# Altium schematic sheet controller_board.SchDoc
size A3; SheetNumber: 2; SheetTotal: 5
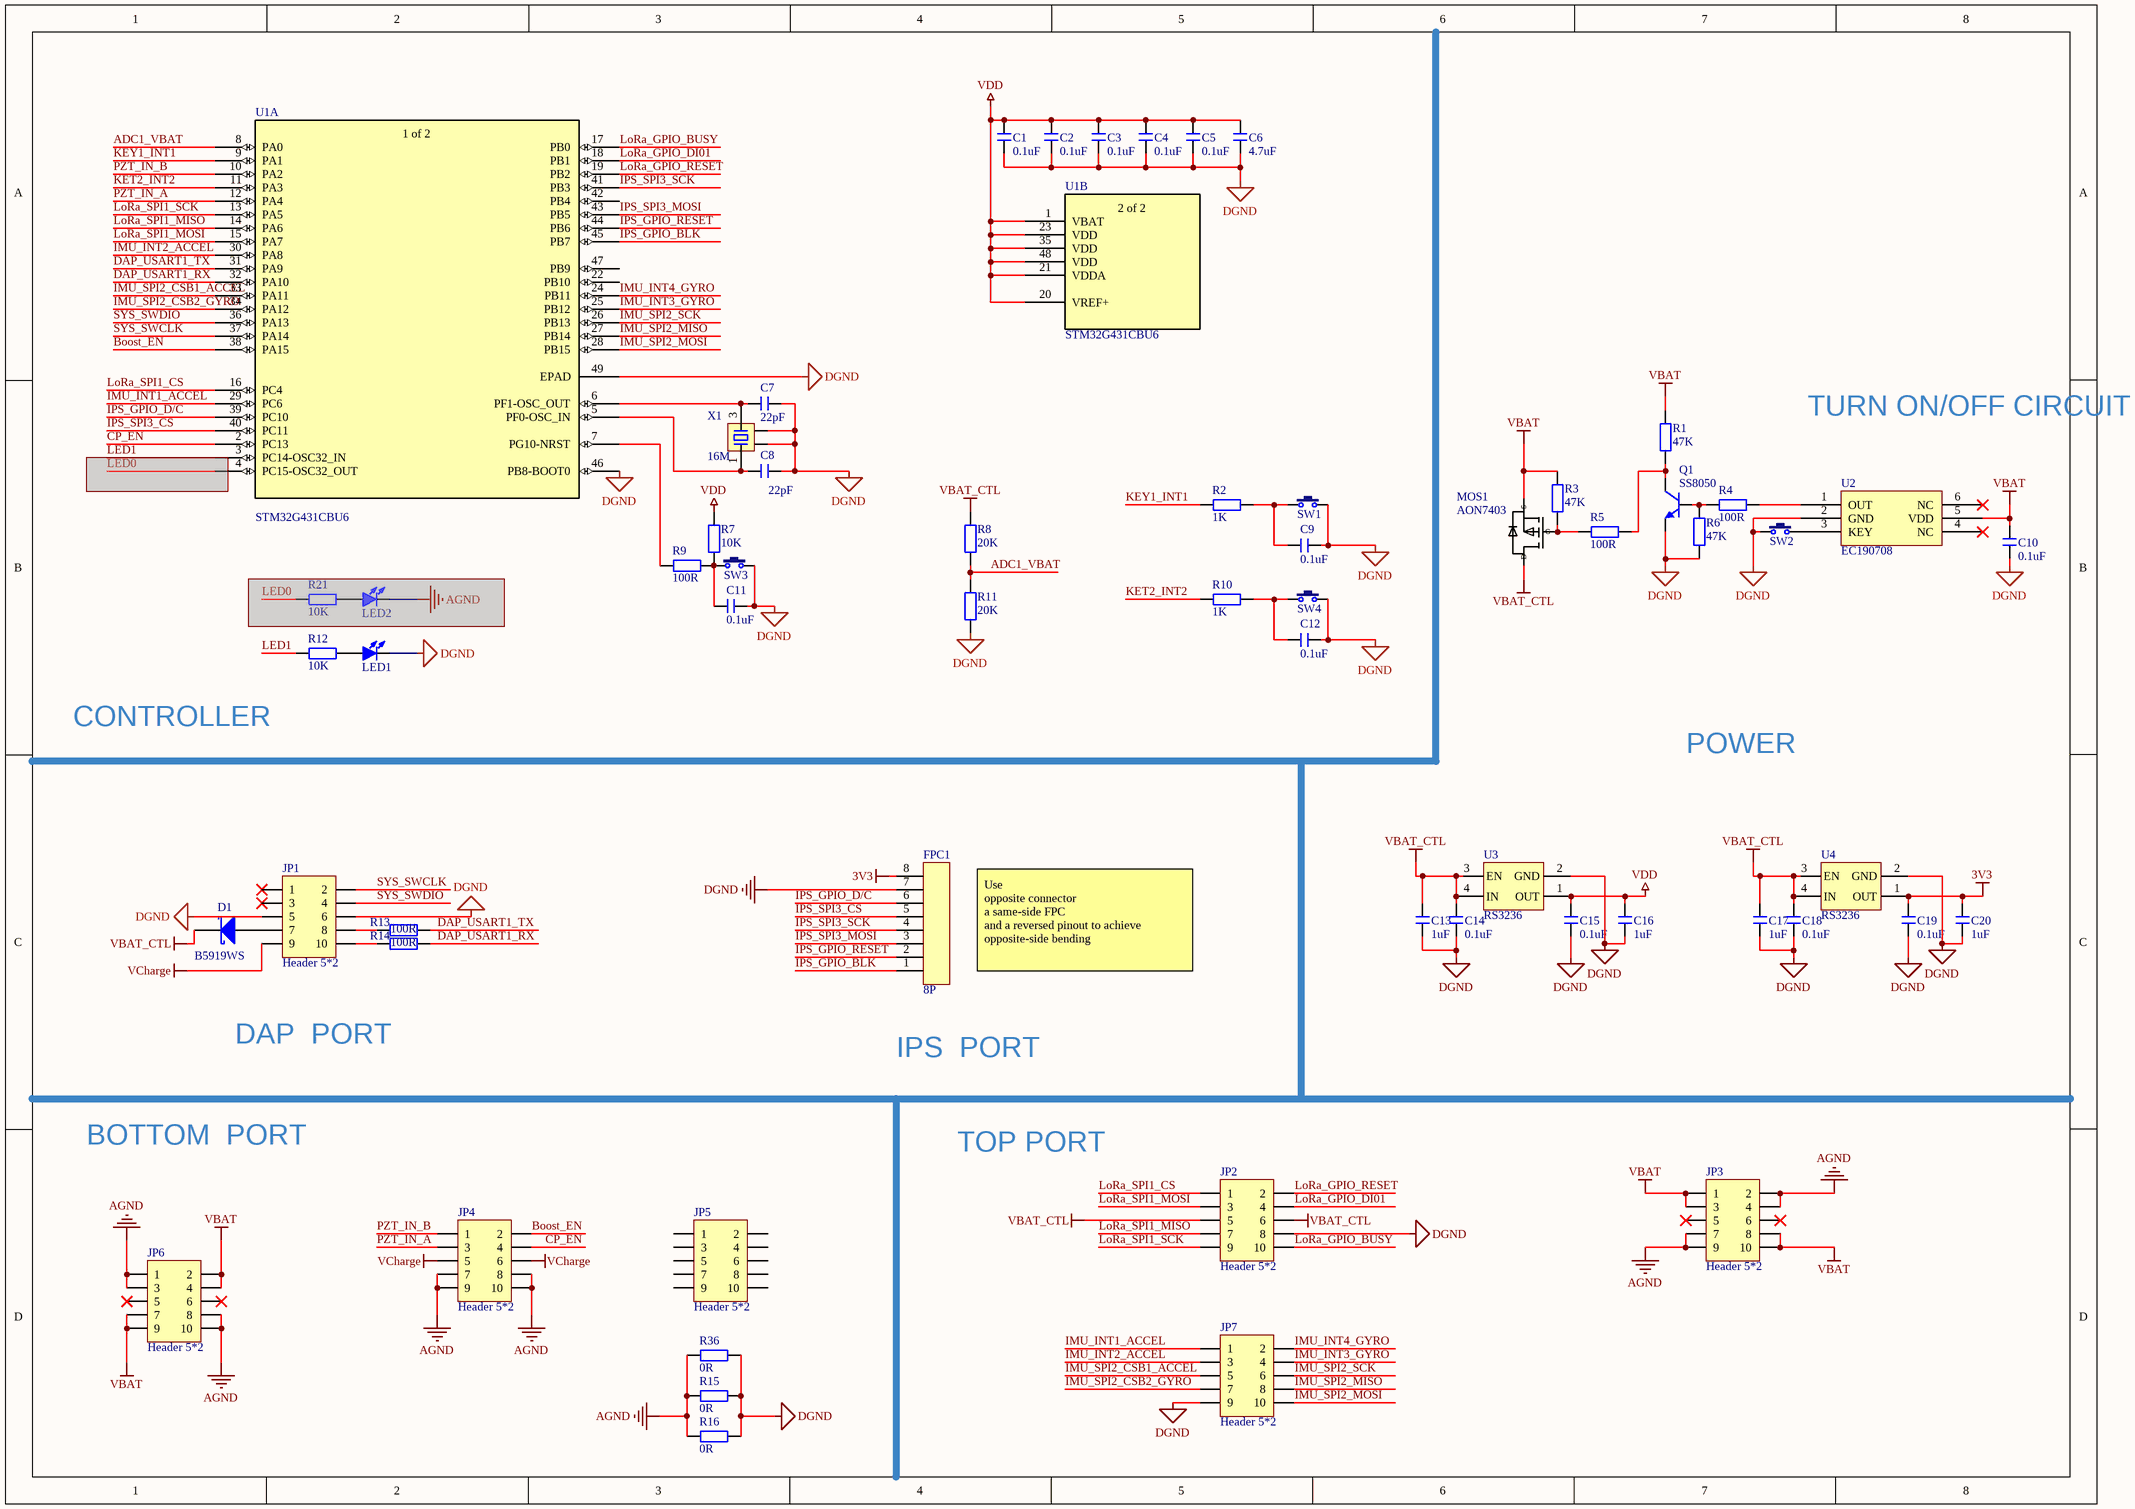
[diagram p0: controller_board.SchDoc]

## Parts
C1  0.1uF  [C 0603_L]
C2  0.1uF  [C 0603_L]
C3  0.1uF  [C 0603_L]
C4  0.1uF  [C 0603_L]
C5  0.1uF  [C 0603_L]
C6  4.7uF  [C 0603_L]
C7  22pF  [C 0603_L]
C8  22pF  [C 0603_L]
C9  0.1uF  [C 0603_L]
C10  0.1uF  [C 0603_L]
C11  0.1uF  [C 0603_L]
C12  0.1uF  [C 0603_L]
C13  1uF  [C 0603_L]
C14  0.1uF  [C 0603_L]
C15  0.1uF  [C 0603_L]
C16  1uF  [C 0603_L]
C17  1uF  [C 0603_L]
C18  0.1uF  [C 0603_L]
C19  0.1uF  [C 0603_L]
C20  1uF  [C 0603_L]
D1  B5919WS  [SOD-523]
FPC1  8P  [FPC0.5 2H-WS-8P]
JP1  Header 5*2  [BTB-0.8MM-SMD-BF-2*5PIN]
JP2  Header 5*2  [BTB-0.8mm-SMD-F-2*5PIN]
JP3  Header 5*2  [BTB-0.8mm-SMD-F-2*5PIN]
JP4  Header 5*2  [BTB-0.8mm-SMD-F-2*5PIN]
JP5  Header 5*2  [BTB-0.8mm-SMD-F-2*5PIN]
JP6  Header 5*2  [BTB-0.8mm-SMD-F-2*5PIN]
JP7  Header 5*2  [BTB-0.8mm-SMD-F-2*5PIN]
LED1  红色  [LED 0603G]  (value not drawn)
LED2  红色  [LED 0603G]  (value not drawn)  (masked out: inside a compile mask, not in the netlist)
MOS1  AON7403  [DFN3x3_8]
Q1  SS8050  [SOT23-3L]
R1  47K  [R 0603_L]
R2  1K  [R 0603_L]
R3  47K  [R 0603_L]
R4  100R  [R 0603_L]
R5  100R  [R 0603_L]
R6  47K  [R 0603_L]
R7  10K  [R 0603_L]
R8  20K  [R 0603_L]
R9  100R  [R 0603_L]
R10  1K  [R 0603_L]
R11  20K  [R 0603_L]
R12  10K  [R 0603_L]
R13  100R  [R 0603_L]
R14  100R  [R 0603_L]
R15  0R  [R 0603_L]
R16  0R  [R 0603_L]
R21  10K  [R 0603_L]  (masked out: inside a compile mask, not in the netlist)
R36  0R  [R 0603_L]
SW1  3x6x5  [TSW 2*4*3.5-S-W]  (value not drawn)
SW2  3x6x5  [TSW 2*4*3.5-S-W]  (value not drawn)
SW3  3x6x5  [TSW 2*4*3.5-S-W]  (value not drawn)
SW4  3x6x5  [TSW 2*4*3.5-S-W]  (value not drawn)
U1  STM32G431CBU6  [QFN48 7X7_L]  (parts A,B of 2)
U2  EC190708  [SOT23-6L]
U3  RS3236  [UTDFN1x1-4]
U4  RS3236  [UTDFN1x1-4]
X1  16M  [OSC 2025-4P]

## Nets
3V3: C19.1 C20.2 FPC1.8 U4.1(OUT)
AGND: JP3.2 JP3.4 JP3.7 JP3.9 JP4.7 JP4.8 JP4.9 JP4.10 JP6.1 JP6.3 JP6.8 JP6.10 R15.2 R16.2 R36.2
DGND: C1.1 C2.1 C3.1 C4.1 C5.1 C6.1 C7.2 C8.2 C9.2 C10.1 C11.2 C12.2 C13.1 C14.2 C15.2 C16.1 C17.1 C18.2 C19.2 C20.1 FPC1.7 JP1.5 JP1.6 JP2.8 JP7.9 LED1.2(K) Q1.2(E) R6.2 R11.1 R15.1 R16.1 R36.1 SW1.2 SW2.1 SW3.2 SW4.2 U1.46(PB8-BOOT0) U1.49(EPAD) U2.2(GND) U3.2(GND) U4.2(GND) X1.2 X1.4
VBAT: C10.2 JP3.1 JP3.3 JP3.8 JP3.10 JP6.2 JP6.4 JP6.7 JP6.9 MOS1.1(S) R1.2 R3.1 U2.5(VDD)
VBAT_CTL: C13.2 C14.1 C17.2 C18.1 D1.2(K) JP2.5 JP2.6 MOS1.3(D) R8.1 U3.3(EN) U3.4(IN) U4.3(EN) U4.4(IN)
VCharge: JP1.9 JP4.5 JP4.6
VDD: C1.2 C2.2 C3.2 C4.2 C5.2 C6.2 C15.1 C16.2 R7.1 U1.1(VBAT) U1.20(VREF+) U1.21(VDDA) U1.23(VDD) U1.35(VDD) U1.48(VDD) U3.1(OUT)
ADC1_VBAT: R8.2 R11.2 U1.8(PA0)
Boost_EN: JP4.2 U1.38(PA15)
CP_EN: JP4.4 U1.2(PC13)
DAP_USART1_RX: R14.1 U1.32(PA10)
DAP_USART1_TX: R13.1 U1.31(PA9)
IMU_INT1_ACCEL: JP7.1 U1.29(PC6)
IMU_INT2_ACCEL: JP7.3 U1.30(PA8)
IMU_INT3_GYRO: JP7.4 U1.25(PB12)
IMU_INT4_GYRO: JP7.2 U1.24(PB11)
IMU_SPI2_CSB1_ACCEL: JP7.5 U1.33(PA11)
IMU_SPI2_CSB2_GYRO: JP7.7 U1.34(PA12)
IMU_SPI2_MISO: JP7.8 U1.27(PB14)
IMU_SPI2_MOSI: JP7.10 U1.28(PB15)
IMU_SPI2_SCK: JP7.6 U1.26(PB13)
IPS_GPIO_BLK: FPC1.1 U1.45(PB7)
IPS_GPIO_D/C: FPC1.6 U1.39(PC10)
IPS_GPIO_RESET: FPC1.2 U1.44(PB6)
IPS_SPI3_CS: FPC1.5 U1.40(PC11)
IPS_SPI3_MOSI: FPC1.3 U1.43(PB5)
IPS_SPI3_SCK: FPC1.4 U1.41(PB3)
KET2_INT2: R10.1 U1.11(PA3)
KEY1_INT1: R2.1 U1.9(PA1)
LED1: R12.2
LoRa_GPIO_BUSY: JP2.10 U1.17(PB0)
LoRa_GPIO_DI01: JP2.4 U1.18(PB1)
LoRa_GPIO_RESET: JP2.2 U1.19(PB2)
LoRa_SPI1_CS: JP2.1 U1.16(PC4)
LoRa_SPI1_MISO: JP2.7 U1.14(PA6)
LoRa_SPI1_MOSI: JP2.3 U1.15(PA7)
LoRa_SPI1_SCK: JP2.9 U1.13(PA5)
PZT_IN_A: JP4.3 U1.12(PA4)
PZT_IN_B: JP4.1 U1.10(PA2)
SYS_SWCLK: JP1.2 U1.37(PA14)
SYS_SWDIO: JP1.4 U1.36(PA13)
NetC7_1: C7.1 U1.6(PF1-OSC_OUT) X1.3
NetC8_1: C8.1 U1.5(PF0-OSC_IN) X1.1
NetC9_1: C9.1 R2.2 SW1.1
NetC11_1: C11.1 R7.2 R9.1 SW3.1
NetC12_1: C12.1 R10.2 SW4.1
NetD1_1: D1.1(A) JP1.7
NetJP1_8: JP1.8 R13.2
NetJP1_10: JP1.10 R14.2
NetLED1_1: LED1.1(A) R12.1
NetMOS1_2: MOS1.2(G) R3.2 R5.1
NetQ1_1: Q1.1(B) R4.1 R6.1
NetQ1_3: Q1.3(C) R1.1 R5.2
NetR4_2: R4.2 U2.1(OUT)
NetR9_2: R9.2 U1.7(PG10-NRST)
NetSW2_2: SW2.2 U2.3(KEY)

Not connected (* = marked no-connect by the designer): JP1 1* 3*; JP3 5* 6*; JP5 1 2 3 4 5 6 7 8 9 10; JP6 5* 6*; U1 3(PC14-OSC32_IN) 4(PC15-OSC32_OUT) 22(PB10) 42(PB4) 47(PB9); U2 4(NC)* 6(NC)*

## Notes on the sheet
- TURN ON/OFF CIRCUIT
- CONTROLLER
- POWER
- Use
  opposite connector
  a same-side FPC
  and a reversed pinout to achieve opposite-side bending
- DAP  PORT
- IPS  PORT
- BOTTOM  PORT
- TOP PORT
- (in symbol STM32G431CBU6, part A) 1 of 2
- (in symbol STM32G431CBU6, part B) 2 of 2

## Library data of the parts
C1-C20 = C: 贴片电容; BOM名称: 无极性贴片电容; 淘宝ID: 封装库来自淘宝 ID：黄晶宝石; 联系售后: https://shop463601444.taobao.com
D1 = 1N5819: 肖特基二极管; 淘宝ID: 封装库来自淘宝 ID：黄晶宝石; 属性: 40V/2A; BOM名称: 肖特基二极管; 欢迎光临: https://shop463601444.taobao.com
JP1-JP7 = Header 5*2: BTB Connector
LED1 LED2 = LED-SMD: 贴片LED; 版权归属: 封装库来自淘宝 ID：黄晶宝石; BOM名称: 贴片LED; 学习资源: https://shop463601444.taobao.com
MOS1 = AON7403: P沟道30V MOSFET
Q1 = 8050-SMD: 高频放大-NPN型; 版权归属: 封装库来自淘宝 ID：黄晶宝石; 属性: 40V 1.5A 1W 100MHZ; BOM名称: 高频放大-NPN型; 联系售后: https://shop463601444.taobao.com
R1-R16 R21 R36 = R: 贴片电阻; 版权归属: 来自淘宝 ID：黄晶宝石; BOM名称: 贴片电阻; 联系售后: https://shop463601444.taobao.com
SW1-SW4 = TSW 3x6: 3x6轻触开关; 版权归属: 封装库来自淘宝 ID：黄晶宝石; BOM名称: 3x6轻触开关; 学习资源: www.ooocke.com
U1 = STM32G431CBU6: 带DSP和FPU的170MHz主流ARM Cortex-M4 MCU，具有128KB Flash存储器、数学加速器和中等模拟电平集成; Mfr_Name: STMicroelectronics; RefDes: RefDes; Type: Type
U2 = EC190708: 长按三秒开关机
U3 U4 = RS3236: 500mA LDO
X1 = XTAL-4P: 4脚无源晶振; 版权归属: 源创客; BOM名称: 4脚无源晶振; 学习资源: www.ooocke.com